# Altium schematic sheet CC-S00-V00-ChassisController.SchDoc: Chassis Controller (Interim) 2020
size A3; DrawnBy: Jonn Dillon; DocumentNumber: 1; SheetNumber: 1; SheetTotal: 13; Project: Chassis Controller (Interim) 2020
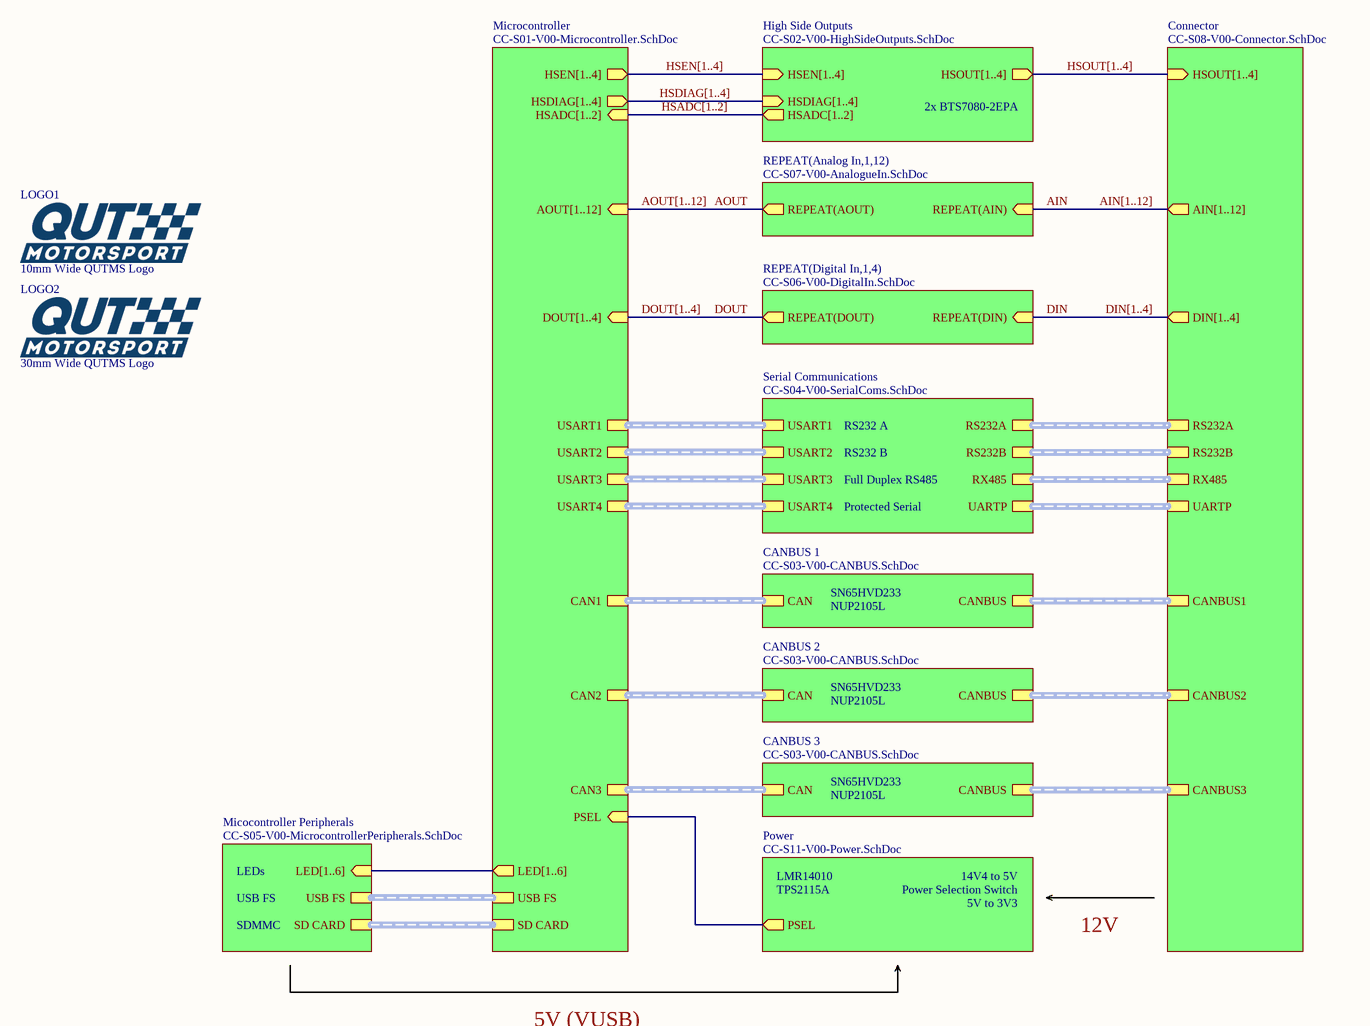
[diagram p0: CC-S00-V00-ChassisController.SchDoc]

## Parts
LOGO1  10mm Wide QUTMS Logo  [QUTMS LOGO 10MM]
LOGO2  30mm Wide QUTMS Logo  [QUTMS LOGO 30MM]

## Sub-sheets
CANBUS 1 = CC-S03-V00-CANBUS.SchDoc: CANBUS (harness CANBUS), CAN (harness CAN)
CANBUS 2 = CC-S03-V00-CANBUS.SchDoc: CANBUS (harness CANBUS), CAN (harness CAN)
CANBUS 3 = CC-S03-V00-CANBUS.SchDoc: CAN (harness CAN), CANBUS (harness CANBUS)
Connector = CC-S08-V00-Connector.SchDoc: HSOUT[1..4] (in), CANBUS1 (harness CANBUS), CANBUS2 (harness CANBUS), CANBUS3 (harness CANBUS), AIN[1..12] (out), DIN[1..4] (out), RS232A (harness RS232), RS232B (harness RS232), RX485 (harness RS485), UARTP (harness UART)
High Side Outputs = CC-S02-V00-HighSideOutputs.SchDoc: HSDIAG[1..4] (in), HSOUT[1..4] (out), HSADC[1..2] (out), HSEN[1..4] (in)
Micocontroller Peripherals = CC-S05-V00-MicrocontrollerPeripherals.SchDoc: USB FS (harness USB FS), SD CARD (harness SD CARD), LED[1..6] (in)
Microcontroller = CC-S01-V00-Microcontroller.SchDoc: USB FS (harness USB FS), SD CARD (harness SD CARD), PSEL (in), USART1 (harness UART), USART2 (harness UART), USART3 (harness UART), USART4 (harness UART), HSEN[1..4] (out), HSDIAG[1..4] (out), HSADC[1..2] (in), CAN3 (harness CAN), CAN2 (harness CAN), CAN1 (harness CAN), DOUT[1..4] (in), AOUT[1..12] (in), LED[1..6] (out)
Power = CC-S11-V00-Power.SchDoc: PSEL (out)
REPEAT(Analog In,1,12) = CC-S07-V00-AnalogueIn.SchDoc: REPEAT(AIN) (in), REPEAT(AOUT) (out)
REPEAT(Digital In,1,4) = CC-S06-V00-DigitalIn.SchDoc: REPEAT(DOUT) (out), REPEAT(DIN) (in)
Serial Communications = CC-S04-V00-SerialComs.SchDoc: USART2 (harness UART), USART4 (harness UART), USART1 (harness UART), USART3 (harness UART), RS232B (harness RS232), RS232A (harness RS232), RX485 (harness RS485), UARTP (harness UART)

## Nets
AIN: sheet REPEAT(Analog In,1,12)/REPEAT(AIN)
AOUT: sheet REPEAT(Analog In,1,12)/REPEAT(AOUT)
DIN: sheet REPEAT(Digital In,1,4)/REPEAT(DIN)
DOUT: sheet REPEAT(Digital In,1,4)/REPEAT(DOUT)
(unnamed): sheet Microcontroller/PSEL, sheet Power/PSEL

## Buses and harness runs
bus AIN[1..12] = sheet Connector/AIN[1..12]
bus AOUT[1..12] = sheet Microcontroller/AOUT[1..12]
bus DIN[1..4] = sheet Connector/DIN[1..4]
bus DOUT[1..4] = sheet Microcontroller/DOUT[1..4]
bus HSADC[1..2] = sheet High Side Outputs/HSADC[1..2] = sheet Microcontroller/HSADC[1..2]
bus HSDIAG[1..4] = sheet High Side Outputs/HSDIAG[1..4] = sheet Microcontroller/HSDIAG[1..4]
bus HSEN[1..4] = sheet High Side Outputs/HSEN[1..4] = sheet Microcontroller/HSEN[1..4]
bus HSOUT[1..4] = sheet Connector/HSOUT[1..4] = sheet High Side Outputs/HSOUT[1..4]
bus sheet Micocontroller Peripherals/LED[1..6] = sheet Microcontroller/LED[1..6]
harness sheet CANBUS 1/CAN = sheet Microcontroller/CAN1
harness sheet CANBUS 1/CANBUS = sheet Connector/CANBUS1
harness sheet CANBUS 2/CAN = sheet Microcontroller/CAN2
harness sheet CANBUS 2/CANBUS = sheet Connector/CANBUS2
harness sheet CANBUS 3/CAN = sheet Microcontroller/CAN3
harness sheet CANBUS 3/CANBUS = sheet Connector/CANBUS3
harness sheet Connector/RS232A = sheet Serial Communications/RS232A
harness sheet Connector/RS232B = sheet Serial Communications/RS232B
harness sheet Connector/RX485 = sheet Serial Communications/RX485
harness sheet Connector/UARTP = sheet Serial Communications/UARTP
harness sheet Micocontroller Peripherals/SD CARD = sheet Microcontroller/SD CARD
harness sheet Micocontroller Peripherals/USB FS = sheet Microcontroller/USB FS
harness sheet Microcontroller/USART1 = sheet Serial Communications/USART1
harness sheet Microcontroller/USART2 = sheet Serial Communications/USART2
harness sheet Microcontroller/USART3 = sheet Serial Communications/USART3
harness sheet Microcontroller/USART4 = sheet Serial Communications/USART4

## Notes on the sheet
- 2x BTS7080-2EPA
- RS232 A
- RS232 B
- Full Duplex RS485
- Protected Serial
- SN65HVD233
- NUP2105L
- USB FS
- LEDs
- LMR14010
- TPS2115A
- 14V4 to 5V
- Power Selection Switch
- SDMMC
- 5V to 3V3
- 12V
- 5V (VUSB)
- Revision History:
- Sheet Title:
- Rev
- Date
- Description
- Project:
- Size:
- Drawn By:
- A3
- Number:
- Revision:
- Sheet
- Version:
- of
- QUT Motorsport
- O-120, Gardens Point
- 2 George Street
- Brisbane, QLD 4000
- Australia
- Print Date:
- Print Time:
- File Name:

## Library data of the parts
LOGO1 = QUTMS Logo 10mm
LOGO2 = QUTMS Logo 30mm